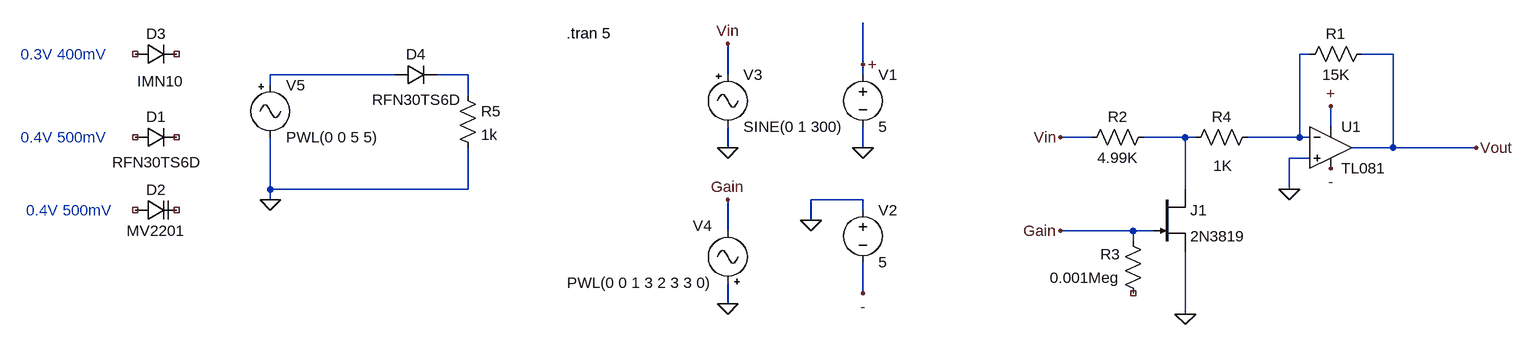
[diagram p0: schematic Amplitude modulator.asc]
Amplitude modulator.asc, the LTspice schematic file:
Version 4
SHEET 1 1112 680
WIRE 560 -48 544 -48
WIRE 688 -48 640 -48
WIRE -128 -32 -128 -96
WIRE -848 -16 -1040 -16
WIRE -736 -16 -784 -16
WIRE -336 -16 -336 -64
WIRE -128 -16 -128 -32
WIRE -1040 0 -1040 -16
WIRE -736 16 -736 -16
WIRE 592 64 592 32
WIRE 224 80 176 80
WIRE 368 80 304 80
WIRE 384 80 368 80
WIRE 544 80 544 -48
WIRE 544 80 464 80
WIRE 560 80 544 80
WIRE -336 96 -336 64
WIRE -128 96 -128 64
WIRE 688 96 688 -48
WIRE 688 96 624 96
WIRE 816 96 688 96
WIRE 560 112 528 112
WIRE -1040 160 -1040 80
WIRE -736 160 -736 96
WIRE -736 160 -1040 160
WIRE 368 160 368 80
WIRE 528 160 528 112
WIRE -1040 176 -1040 160
WIRE -128 176 -208 176
WIRE -128 192 -128 176
WIRE -208 208 -208 176
WIRE -336 224 -336 176
WIRE 288 224 176 224
WIRE 320 224 288 224
WIRE 288 240 288 224
WIRE -128 320 -128 272
WIRE -336 336 -336 304
WIRE 368 352 368 256
FLAG 368 352 0
FLAG 528 160 0
FLAG -128 96 0
FLAG -208 208 0
FLAG 592 32 +
FLAG 592 128 -
FLAG -128 320 -
FLAG -128 -32 +
FLAG -336 96 0
FLAG -336 -64 Vin
FLAG 176 80 Vin
FLAG 176 224 Gain
FLAG 816 96 Vout
FLAG -336 336 0
FLAG -336 176 Gain
FLAG -1040 176 0
SYMBOL AutoGenerated\\TL081 592 32 R0
SYMATTR InstName U1
SYMBOL voltage -128 -32 R0
WINDOW 123 0 0 Left 0
WINDOW 39 0 0 Left 0
SYMATTR InstName V1
SYMATTR Value 5
SYMBOL voltage -128 176 R0
WINDOW 123 0 0 Left 0
WINDOW 39 0 0 Left 0
SYMATTR InstName V2
SYMATTR Value 5
SYMBOL njf 320 160 R0
SYMATTR InstName J1
SYMATTR Value 2N3819
SYMBOL res 656 -64 R90
WINDOW 0 0 56 VBottom 2
WINDOW 3 32 56 VTop 2
SYMATTR InstName R1
SYMATTR Value 15K
SYMATTR SpiceLine tol=1 pwr=0.1
SYMBOL res 320 64 R90
WINDOW 0 0 56 VBottom 2
WINDOW 3 32 56 VTop 2
SYMATTR InstName R2
SYMATTR Value 4.99K
SYMATTR SpiceLine tol=1 pwr=0.1
SYMBOL res 304 336 R180
WINDOW 0 36 76 Left 2
WINDOW 3 36 40 Left 2
SYMATTR InstName R3
SYMATTR Value 0.001Meg
SYMATTR SpiceLine tol=1 pwr=0.1
SYMBOL res 368 96 R270
WINDOW 0 32 56 VTop 2
WINDOW 3 -12 58 VBottom 2
SYMATTR InstName R4
SYMATTR Value 1K
SYMATTR SpiceLine tol=1 pwr=0.1
SYMBOL Misc\\signal -336 -32 R0
WINDOW 123 0 0 Left 0
WINDOW 39 0 0 Left 0
SYMATTR InstName V3
SYMATTR Value SINE(0 1 300)
SYMBOL Misc\\signal -336 320 R180
WINDOW 0 24 104 Left 2
WINDOW 3 24 16 Left 2
WINDOW 123 0 0 Left 0
WINDOW 39 0 0 Left 0
SYMATTR InstName V4
SYMATTR Value PWL(0 0 1 3 2 3 3 0)
SYMBOL diode -1248 -32 R270
WINDOW 0 32 32 VTop 2
WINDOW 3 -10 39 VBottom 2
SYMATTR InstName D3
SYMATTR Value IMN10
SYMBOL Misc\\signal -1040 -16 R0
WINDOW 123 0 0 Left 0
WINDOW 39 0 0 Left 0
SYMATTR InstName V5
SYMATTR Value PWL(0 0 5 5)
SYMBOL res -752 0 R0
SYMATTR InstName R5
SYMATTR Value 1k
SYMBOL diode -1248 96 R270
WINDOW 0 32 32 VTop 2
WINDOW 3 -7 34 VBottom 2
SYMATTR InstName D1
SYMATTR Value RFN30TS6D
SYMBOL varactor -1248 176 M90
WINDOW 0 0 32 VBottom 2
WINDOW 3 32 32 VTop 2
SYMATTR InstName D2
SYMATTR Value MV2201
SYMATTR Type diode
SYMBOL diode -848 0 R270
WINDOW 0 32 32 VTop 2
WINDOW 3 -7 34 VBottom 2
SYMATTR InstName D4
SYMATTR Value RFN30TS6D
TEXT -584 -80 Left 2 !.tran 5
TEXT -1424 -48 Left 2 ;0.3V 400mV
TEXT -1424 80 Left 2 ;0.4V 500mV
TEXT -1416 192 Left 2 ;0.4V 500mV

The netlist it stands for:
* Amplitude modulator.asc
* U1: TL081 (symbol AutoGenerated\TL081 not available, pins judged from their places): In+=0 In-=N001 V+=+ V-=- OUT=Vout
V1 + 0 5
V2 0 - 5
J1 N004 Gain 0 2N3819
R1 Vout N001 15K tol=1 pwr=0.1
R2 N004 Vin 4.99K tol=1 pwr=0.1
R3 NC_01 Gain 0.001Meg tol=1 pwr=0.1
R4 N004 N001 1K tol=1 pwr=0.1
V3 Vin 0 SINE(0 1 300)
V4 0 Gain PWL(0 0 1 3 2 3 3 0)
D3 NC_02 NC_03 IMN10
V5 N002 0 PWL(0 0 5 5)
R5 N003 0 1k
D1 NC_04 NC_05 RFN30TS6D
D2 NC_06 NC_07 MV2201
D4 N002 N003 RFN30TS6D
.model D D
.lib standard.dio
.model NJF NJF
.model PJF PJF
.lib standard.jft
.tran 5
* 0.3V 400mV
* 0.4V 500mV
* 0.4V 500mV
.backanno
.end